# EAGLE design encoder_board (EAGLE 8.6.0)
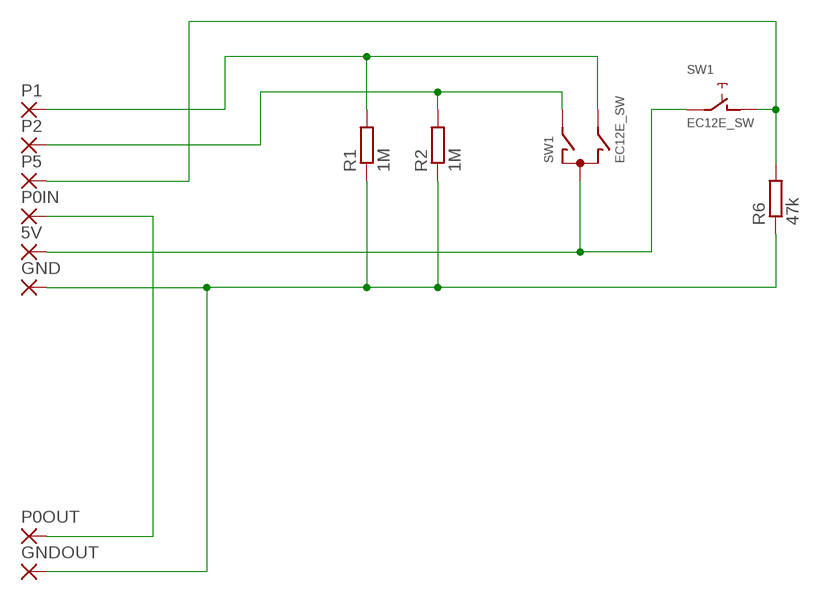
[diagram p0: schematic, sheet 1]

## Parts
5V  2,54/0,8  [2,54/0,8]
GND  2,54/0,8  [2,54/0,8]
GNDOUT  2,54/0,8  [2,54/0,8]
P0IN  2,54/0,8  [2,54/0,8]
P0OUT  2,54/0,8  [2,54/0,8]
P1  2,54/0,8  [2,54/0,8]
P2  2,54/0,8  [2,54/0,8]
P5  2,54/0,8  [2,54/0,8]
R1  1M  R-EU_0204/7  [0204/7]
R2  1M  R-EU_0204/7  [0204/7]
R6  47k  R-EU_0204/7  [0204/7]
SW1  EC12E_SW  [ALPS_EC12E_SW]

## Nets
GND2: GND.1(P) GNDOUT.1(P) R1.1 R2.1 R6.1
N$1: P0IN.1(P) P0OUT.1(P)
N$3: P5.1(P) R6.2 SW1.D
N$4: P2.1(P) R2.2 SW1.A
N$5: P1.1(P) R1.2 SW1.B
N$7: 5V.1(P) SW1.C SW1.E
Unconnected: SW1.GND1(G) SW1.GND2(G)

## Library data of the parts
5V GND GNDOUT P0IN P0OUT P1 P2 P5 = wirepad:2,54/0,8: THROUGH-HOLE PAD
R1 R2 R6 = resistor:R-EU_: RESISTOR, European symbol
SW1 = switch-alps:EC12E_SW: ALPS rotary Encoder EC12E series with switch; MPN: EC12E2424407; OC_FARNELL: 1520813; OC_NEWARK: 74M1068

## Board
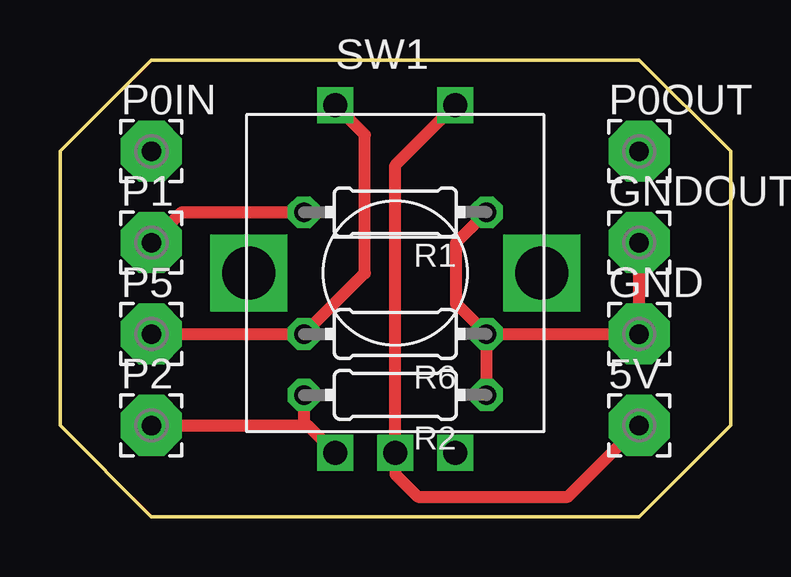
[diagram p1: board, top side]
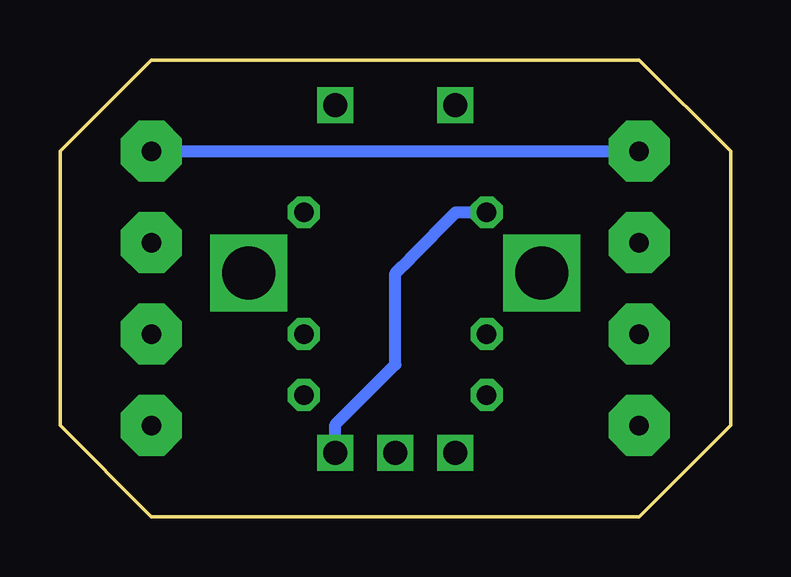
[diagram p2: board, bottom side, seen from below]

Size 27.94 x 19.05 mm. Coordinates in mm from the lower left corner, seen from the top.
Outline: 24.13,0 27.94,3.81 27.94,15.24 24.13,19.05 3.81,19.05 0,15.24 0,3.81 3.81,0 24.13,0
Copper layers (1*16): Top 0.035mm / dielectric 1.5mm / Bottom 0.035mm
Design rules "default *": minimum track width 10mil, minimum drill 0.8mm, track to track 10mil, track to pad 10mil, pad to pad 10mil, via to via 10mil, smd to smd 10mil, copper to edge 20mil, drill to drill 20mil, minimum pad ring 10mil, minimum via ring 8mil, stop-mask expansion 4mil, vias tented up to drill 0mil, thermal gap 10mil

### Footprints (pad centres in the part's own frame; a part is rotated, then mirrored left to right if it is on the bottom)
2,54/0,8 = drill 0.813 pad 2.54 octagon: 1 0,0
0204/7 = drill 0.813 octagon: 1 -3.81,0; 2 3.81,0
ALPS_EC12E_SW = drill 1 square: A -2.5,-7.5; B 2.5,-7.5; C 0,-7.5; D -2.5,7; E 2.5,7 | drill 2.2 square: GND1 -6.1,0; GND2 6.1,0

### Placement (x,y rotation side)
5V  24.13,3.81 0 top
GND  24.13,7.62 0 top
GNDOUT  24.13,11.43 0 top
P0IN  3.81,15.24 0 top
P0OUT  24.13,15.24 0 top
P1  3.81,11.43 0 top
P2  3.81,3.81 0 top
P5  3.81,7.62 0 top
R1  13.97,12.7 180 top
R2  13.97,5.08 180 top
R6  13.97,7.62 180 top
SW1  13.97,10.16 0 top

### Tracks (layer width: path | path; a pad name or v marks a point on that pad's centre or on a via)
GND2
  Top 0.508: R2.1 R6.1 | R6.1 GND.1 GNDOUT.1 | R6.1 16.51,8.89 16.51,11.43 R1.1
N$1
  Bottom 0.508: P0OUT.1 P0IN.1
N$3
  Top 0.508: P5.1 R6.2 12.7,10.16 12.7,15.93 SW1.D
N$4
  Top 0.508: SW1.A 10.32,3.81 10.16,3.81 | P2.1 10.16,3.81 | R2.2 10.16,3.81
N$5
  Top 0.508: P1.1 5.08,12.7 R1.2
  Bottom 0.508: SW1.B 16.47,3.85 13.97,6.35 13.97,10.16 13.33,10.8 11.43,12.7 R1.2
N$7
  Top 0.508: SW1.E 13.97,14.66 SW1.C 13.97,1.78 14.91,0.84 21.16,0.84 5V.1